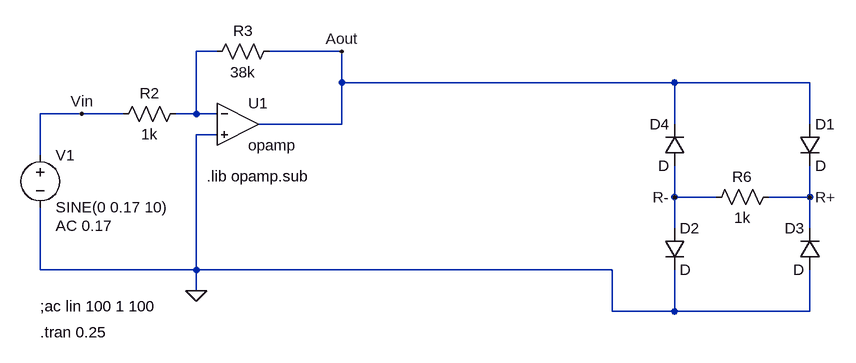
[diagram p0: schematic InvertingAmp with Bridge Rectifier.asc]
InvertingAmp with Bridge Rectifier.asc, the LTspice schematic file:
Version 4
SHEET 1 1684 680
WIRE -144 -160 -176 -160
WIRE 48 -160 -64 -160
WIRE 48 -112 48 -160
WIRE 560 -112 48 -112
WIRE 768 -112 560 -112
WIRE -352 -64 -416 -64
WIRE -288 -64 -352 -64
WIRE -176 -64 -176 -160
WIRE -176 -64 -208 -64
WIRE -144 -64 -176 -64
WIRE 48 -48 48 -112
WIRE 48 -48 -80 -48
WIRE 560 -48 560 -112
WIRE 768 -48 768 -112
WIRE -144 -32 -176 -32
WIRE -416 0 -416 -64
WIRE 560 64 560 16
WIRE 624 64 560 64
WIRE 768 64 768 16
WIRE 768 64 704 64
WIRE 560 112 560 64
WIRE 768 112 768 64
WIRE -416 176 -416 80
WIRE -176 176 -176 -32
WIRE -176 176 -416 176
WIRE 464 176 -176 176
WIRE -176 208 -176 176
WIRE 464 240 464 176
WIRE 560 240 560 176
WIRE 560 240 464 240
WIRE 768 240 768 176
WIRE 768 240 560 240
FLAG 48 -160 Aout
FLAG -352 -64 Vin
FLAG 768 64 R+
FLAG 560 64 R-
FLAG -176 208 0
SYMBOL voltage -416 -16 R0
WINDOW 123 24 124 Left 2
WINDOW 39 0 0 Left 0
SYMATTR Value2 AC 0.17
SYMATTR InstName V1
SYMATTR Value SINE(0 0.17 10)
SYMBOL res -192 -80 R90
WINDOW 0 0 56 VBottom 2
WINDOW 3 32 56 VTop 2
SYMATTR InstName R2
SYMATTR Value 1k
SYMBOL res -48 -176 R90
WINDOW 0 0 56 VBottom 2
WINDOW 3 32 56 VTop 2
SYMATTR InstName R3
SYMATTR Value 38k
SYMBOL diode 752 -48 R0
SYMATTR InstName D1
SYMBOL diode 544 112 R0
SYMATTR InstName D2
SYMBOL diode 784 176 R180
WINDOW 0 24 64 Left 2
WINDOW 3 24 0 Left 2
SYMATTR InstName D3
SYMBOL diode 576 16 R180
WINDOW 0 24 64 Left 2
WINDOW 3 24 0 Left 2
SYMATTR InstName D4
SYMBOL res 720 48 R90
WINDOW 0 0 56 VBottom 2
WINDOW 3 32 56 VTop 2
SYMATTR InstName R6
SYMATTR Value 1k
SYMBOL OpAmps\\opamp -112 -112 R0
SYMATTR InstName U1
TEXT -416 272 Left 2 !.tran 0.25
TEXT -416 232 Left 2 !;ac lin 100 1 100
TEXT -160 32 Left 2 !.lib opamp.sub

The netlist it stands for:
* InvertingAmp with Bridge Rectifier.asc
V1 Vin 0 SINE(0 0.17 10) AC 0.17
R2 N001 Vin 1k
R3 Aout N001 38k
D1 Aout R+ D
D2 R- 0 D
D3 0 R+ D
D4 R- Aout D
R6 R+ R- 1k
XU1 N001 0 Aout opamp Aol=100K GBW=10Meg  ; pins invin noninvin out
.model D D
.lib standard.dio
.tran 0.25
;ac lin 100 1 100
.lib opamp.sub
.backanno
.end